# EAGLE design ONE BOARD INPUT (EAGLE 8.7.1)
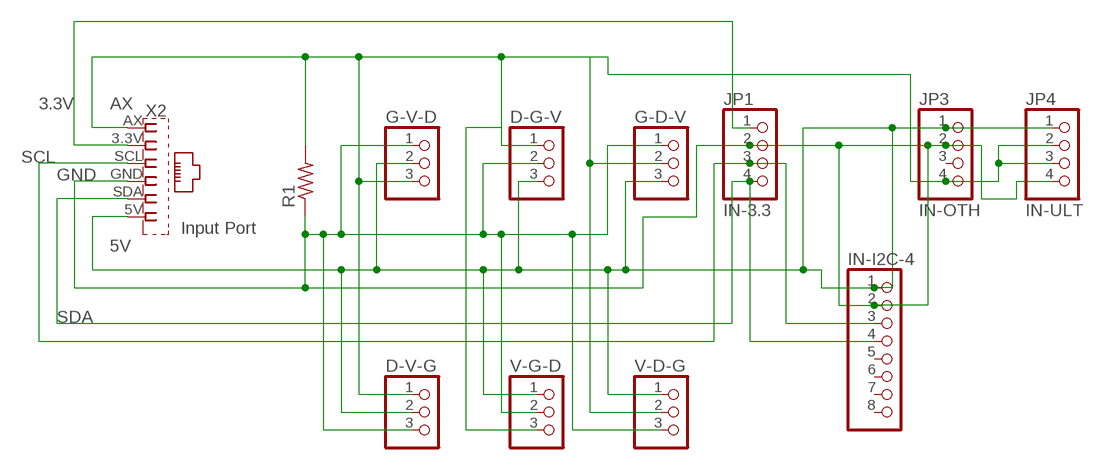
[diagram p0: schematic, sheet 1]

## Parts
D-G-V  PINHD-1X3  [1X03]
D-V-G  PINHD-1X3  [1X03]
G-D-V  PINHD-1X3  [1X03]
G-V-D  PINHD-1X3  [1X03]
IN-I2C-4  PINHD-1X8  [1X08]
JP1  IN-3.3  PINHD-1X4  [1X04]
JP3  IN-OTH  PINHD-1X4  [1X04]
JP4  IN-ULT  PINHD-1X4  [1X04]
R1  R-US_0207/10  [0207/10]
V-D-G  PINHD-1X3  [1X03]
V-G-D  PINHD-1X3  [1X03]
X2  Input Port  ELEMENTORY-RJ11INPUT-DEVICE  [ELEMENTORY-IN-SEN]

## Nets
3.3V: JP1.1 X2.3.3V
5V: D-G-V.3 D-V-G.2 G-D-V.3 G-V-D.2 IN-I2C-4.1 JP3.1 JP4.1 V-D-G.1 V-G-D.1 X2.5V
AX: D-G-V.1 D-V-G.1 G-D-V.2 G-V-D.3 JP3.4 JP4.2 JP4.3 R1.2 V-D-G.2 V-G-D.3 X2.AX
GND: D-G-V.2 D-V-G.3 G-D-V.1 G-V-D.1 IN-I2C-4.2 JP1.2 JP3.2 JP4.4 R1.1 V-D-G.3 V-G-D.2 X2.GND
SCL: IN-I2C-4.3 JP1.3 X2.SCL
SDA: IN-I2C-4.4 JP1.4 X2.SDA
Unconnected: IN-I2C-4.5 IN-I2C-4.6 IN-I2C-4.7 IN-I2C-4.8 JP3.3

## Library data of the parts
D-G-V D-V-G G-D-V G-V-D V-D-G V-G-D = adafruit:PINHD-1X3: PIN HEADER
IN-I2C-4 = pinhead:PINHD-1X8: PIN HEADER
JP1 JP3 JP4 = pinhead:PINHD-1X4: PIN HEADER
R1 = resistor:R-US_: RESISTOR, American symbol
X2 = ELEMENTORY-RJ11-V1.0:ELEMENTORY-RJ11: RJ11 6 connects Source: YH-55-10.pdf

## Board
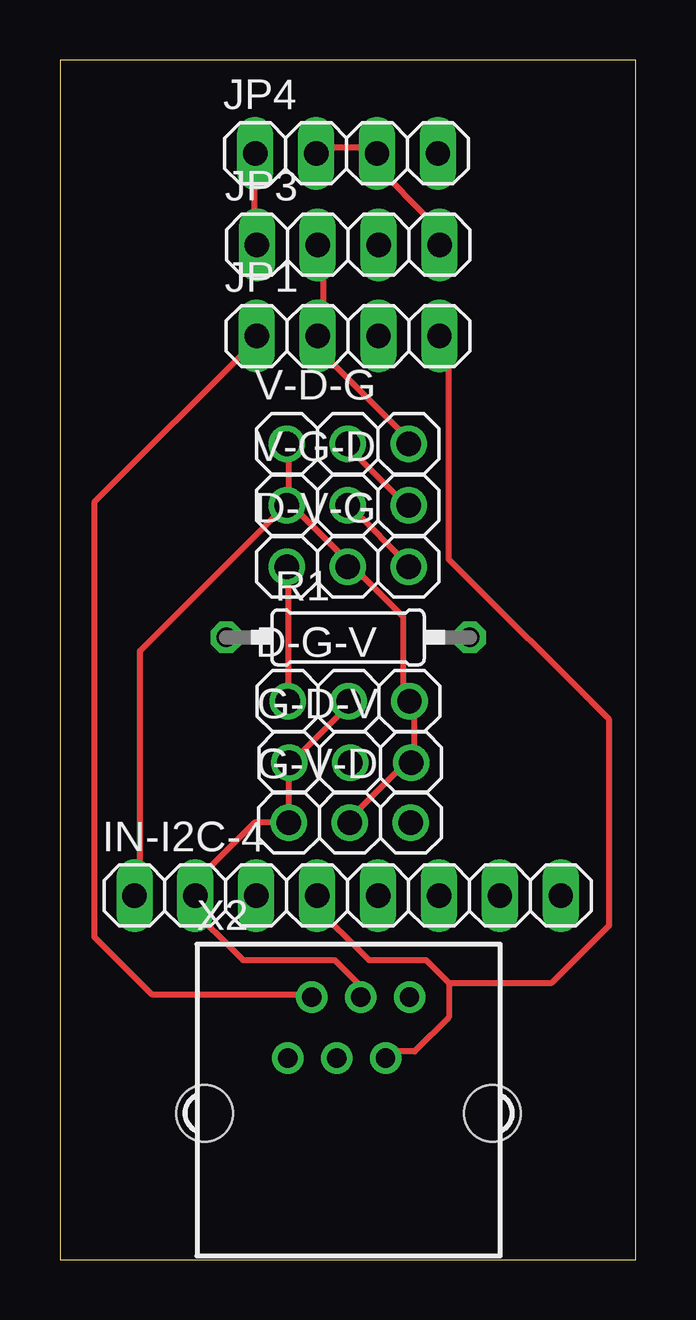
[diagram p1: board, top side]
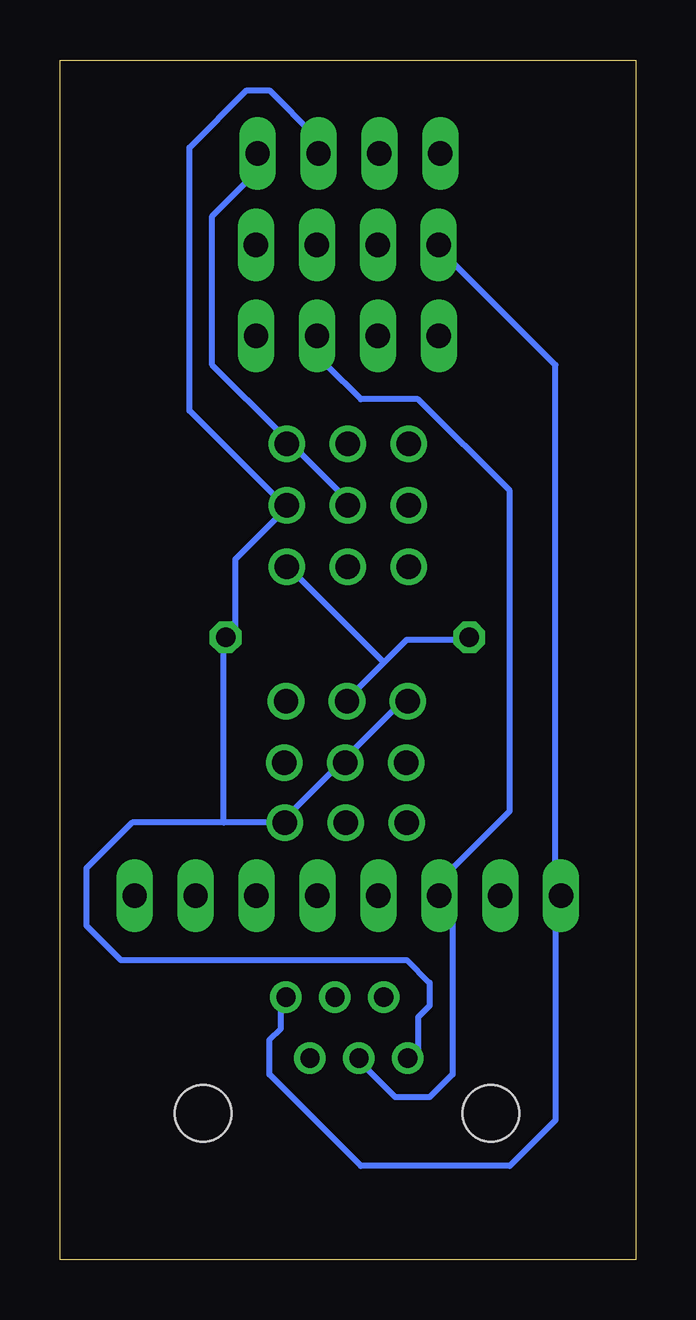
[diagram p2: board, bottom side, seen from below]

Size 24 x 50 mm. Coordinates in mm from the lower left corner, seen from the top.
Outline: 0,0 24,0 24,50 0,50 0,0
Copper layers (1*16): Top 0.035mm / dielectric 1.5mm / Bottom 0.035mm
Design rules "default *": minimum track width 10mil, minimum drill 0.3mm, track to track 0.7mm, track to pad 0.7mm, pad to pad 0.7mm, via to via 0.7mm, smd to smd 6mil, copper to edge 0.7mm, drill to drill 6mil, minimum pad ring 10mil, minimum via ring 8mil, stop-mask expansion 4mil, vias tented up to drill 0mil, thermal gap 10mil

### Footprints (pad centres in the part's own frame; a part is rotated, then mirrored left to right if it is on the bottom)
1X03 = drill 1.016: 1 -2.54,0; 2 0,0; 3 2.54,0
1X08 = drill 1.016 long: 1 -8.89,0; 2 -6.35,0; 3 -3.81,0; 4 -1.27,0; 5 1.27,0; 6 3.81,0; 7 6.35,0; 8 8.89,0
1X04 = drill 1.016 long: 1 -3.81,0; 2 -1.27,0; 3 1.27,0; 4 3.81,0
0207/10 = drill 0.813 octagon: 1 -5.08,0; 2 5.08,0
ELEMENTORY-IN-SEN = drill 0.8 pad 1.3: 3.3V -1.54,4.84; 5V 2.54,4.84; AX -2.54,2.3; GND 0.5,4.84; SCL -0.5,2.3; SDA 1.54,2.3 | hole 2.36: -6,0; 6,0

### Placement (x,y rotation side)
D-G-V  12.03,23.28 0 top
D-V-G  12,28.88 0 top
G-D-V  12.1,20.71 0 top
G-V-D  12.09,18.21 0 top
IN-I2C-4  11.99,15.17 0 top
JP1  12.01,38.49 0 top
JP3  12.02,42.3 0 top
JP4  11.95,46.11 0 top
R1  12.01,25.93 0 top
V-D-G  12,34 0 top
V-G-D  12,31.44 0 top
X2  12.04,6.1 0 top

### Tracks (layer width: path | path; a pad name or v marks a point on that pad's centre or on a via)
3.3V
  Top 0.254: X2.3.3V 10.49,11.06 3.82,11.06 1.43,13.44 1.43,31.57 8.11,38.25 JP1.1
5V
  Top 0.254: G-V-D.2 12.4,18.69 14.31,20.6 G-D-V.3 14.79,21.07 14.79,22.98 D-G-V.3 14.31,23.46 14.31,26.8 12.4,28.7 D-V-G.2 11.93,29.18 9.54,31.57 | 9.54,31.57 9.54,33.95 V-D-G.1 | 9.54,31.57 V-G-D.1 9.06,31.09 3.34,25.37 3.34,15.35 IN-I2C-4.1 | JP4.1 8.11,45.88 8.11,42.54 JP3.1
  Bottom 0.254: X2.5V 14.79,10.58 14.79,9.62 15.26,9.15 15.26,7.72 11.45,3.9 5.25,3.9 3.34,5.81 3.34,14.87 IN-I2C-4.1 3.34,15.35 3.34,37.29 8.11,42.06 JP3.1
AX
  Top 0.254: JP4.2 10.97,46.35 12.88,46.35 JP4.3 12.88,45.88 15.74,43.02 15.74,42.54 JP3.4 | V-D-G.2 12.4,33.95 12.4,33.47 14.31,31.57 V-G-D.3 | D-V-G.1 9.54,28.7 9.54,23.46 D-G-V.1
  Bottom 0.254: JP4.3 13.36,46.35 13.36,46.83 15.26,48.74 16.22,48.74 18.6,46.35 18.6,35.38 14.79,31.57 V-G-D.3 14.79,31.09 16.7,29.18 16.7,26.32 R1.2 17.17,25.84 17.17,18.21 | 17.17,18.21 14.79,18.21 G-V-D.3 14.31,18.69 12.4,20.6 G-D-V.2 11.93,21.07 10.02,22.98 9.54,22.98 D-G-V.1 | 17.17,18.21 20.99,18.21 22.9,16.3 22.9,13.92 21.46,12.49 9.54,12.49 8.59,11.53 8.59,10.58 9.06,10.1 9.06,8.67 X2.AX
GND
  Top 0.254: X2.GND 12.4,11.06 12.4,11.53 11.45,12.49 7.63,12.49 5.25,14.87 IN-I2C-4.2 5.72,15.35 5.72,15.83 8.11,18.21 G-V-D.1 9.54,18.69 9.54,20.6 G-D-V.1 10.02,21.07 11.93,22.98 D-G-V.2 | JP3.2 10.97,42.06 10.97,38.72 JP1.2 10.97,38.25 10.97,37.77 14.31,34.43 V-D-G.3 | V-G-D.2 12.4,31.09 14.31,29.18 D-V-G.3
  Bottom 0.254: 10.49,24.89 11.93,23.46 D-G-V.2 | 10.49,24.89 9.54,25.84 7.16,25.84 R1.1 | V-G-D.2 11.93,31.57 14.31,33.95 V-D-G.3 14.79,34.43 17.65,37.29 17.65,43.49 16.22,44.92 16.22,45.88 JP4.4 | 10.49,24.89 14.31,28.7 D-V-G.3
SCL
  Bottom 0.254: X2.SCL 11.45,8.19 10.02,6.76 8.59,6.76 7.63,7.72 7.63,14.39 8.11,14.87 IN-I2C-4.3 8.59,15.35 5.25,18.69 5.25,32.04 9.06,35.86 11.45,35.86 12.88,37.29 12.88,38.25 JP1.3
SDA
  Top 0.254: 16.22,11.53 16.22,10.1 14.79,8.67 13.83,8.67 X2.SDA | 16.22,11.53 15.26,12.49 12.88,12.49 10.49,14.87 IN-I2C-4.4 | 16.22,11.53 20.51,11.53 22.9,13.92 22.9,22.5 16.22,29.18 16.22,38.25 JP1.4

### Text on the board
200bmp: ONE BOARD INPUT | ELEMENTORY.IN